# EAGLE design layout3 (EAGLE 7.2.0)
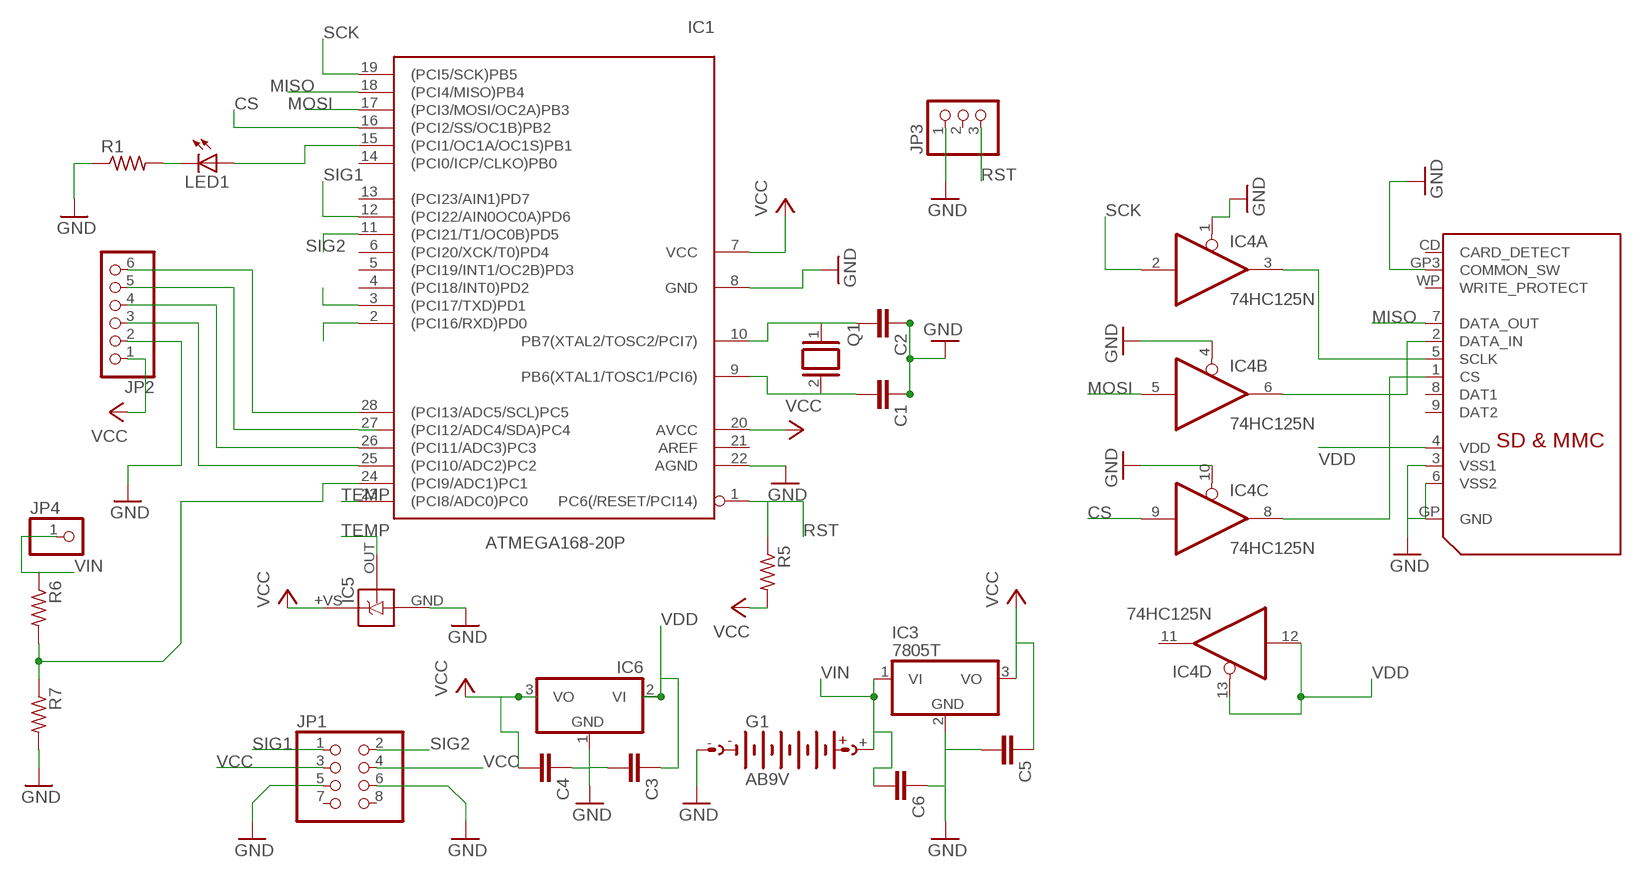
[diagram p0: schematic, sheet 1]

## Parts
C1  C-EU025-025X050  [C025-025X050]
C2  C-EU025-025X050  [C025-025X050]
C3  C-EU025-025X050  [C025-025X050]
C4  C-EU025-025X050  [C025-025X050]
C5  C-EU025-025X050  [C025-025X050]
C6  C-EU025-025X050  [C025-025X050]
G1  AB9V  [AB9V]
IC1  ATMEGA168-20P  [DIL28-3]
IC3  7805T  [TO220H]
IC4  74HC125N  [DIL14]
IC5  LM35  [TO-92-]
IC6  7906T  [TO220H]
JP1  PINHD-2X4  [2X04]
JP2  PINHD-1X6CB  [1X06-CLEANBIG]
JP3  PINHD-1X3CB  [1X03-CLEANBIG]
JP4  PINHD-1X1CB  [1X01-CLEANBIG]
LED1  LED5MM  [LED5MM]
Q1  XTAL/S  [QS]
R1  R-US_0207/10  [0207/10]
R5  R-US_0207/10  [0207/10]
R6  R-US_0207/10  [0207/10]
R7  R-US_0207/10  [0207/10]
U$1  SDMMC06132  [06132]

## Nets
CS: IC1.16((PCI2/SS/OC1B)PB2) IC4.9(C:I)
GND: C1.1 C2.1 C3.2 C4.1 C5.2 C6.1 G1.- IC1.8(GND) IC1.22(AGND) IC3.2(GND) IC4.1(A:OE) IC4.4(B:OE) IC4.10(C:OE) IC5.GND IC6.1(GND) JP1.5 JP1.6 JP2.2 JP3.1 R1.1 R7.2 U$1.3(VSS1) U$1.6(VSS2) U$1.GP3(COMMON_SW) U$1.GP(GND)
MISO: IC1.18((PCI4/MISO)PB4) U$1.7(DATA_OUT)
MOSI: IC1.17((PCI3/MOSI/OC2A)PB3) IC4.5(B:I)
N$1: C1.2 IC1.9(PB6(XTAL1/TOSC1/PCI6)) Q1.2
N$2: C2.2 IC1.10(PB7(XTAL2/TOSC2/PCI7)) Q1.1
N$3: IC1.28((PCI13/ADC5/SCL)PC5) JP2.6
N$4: IC1.26((PCI11/ADC3)PC3) JP2.4
N$5: IC1.27((PCI12/ADC4/SDA)PC4) JP2.5
N$6: IC1.25((PCI10/ADC2)PC2) JP2.3
N$8: IC4.6(B:O) U$1.2(DATA_IN)
N$9: IC4.3(A:O) U$1.5(SCLK)
N$10: IC4.8(C:O) U$1.1(CS)
N$11: IC1.24((PCI9/ADC1)PC1) R6.2 R7.1
N$12: LED1.K(C) R1.2
N$13: IC1.15((PCI1/OC1A/OC1S)PB1) LED1.A
N$21: IC1.2((PCI16/RXD)PD0)
N$22: IC1.3((PCI17/TXD)PD1)
RST: IC1.1(PC6(/RESET/PCI14)) JP3.3 R5.1
SCK: IC1.19((PCI5/SCK)PB5) IC4.2(A:I)
SIG1: IC1.12((PCI22/AIN0OC0A)PD6) JP1.1
SIG2: IC1.11((PCI21/T1/OC0B)PD5) JP1.2
TEMP: IC1.23((PCI8/ADC0)PC0) IC5.OUT
VCC: C4.2 C5.1 IC1.7(VCC) IC1.20(AVCC) IC3.3(VO) IC5.+VS IC6.3(VO) JP1.3 JP1.4 JP2.1 R5.2
VDD: C3.1 IC4.12(D:I) IC4.13(D:OE) IC6.2(VI) U$1.4(VDD)
VIN: C6.2 G1.+ IC3.1(VI) JP4.1 R6.1
Unconnected: IC1.4((PCI18/INT0)PD2) IC1.5((PCI19/INT1/OC2B)PD3) IC1.6((PCI20/XCK/T0)PD4) IC1.13((PCI23/AIN1)PD7) IC1.14((PCI0/ICP/CLKO)PB0) IC1.21(AREF) IC4.11(D:O) JP1.7 JP1.8 JP3.2 U$1.8(DAT1) U$1.9(DAT2) U$1.CD(CARD_DETECT) U$1.WP(WRITE_PROTECT)

## Power pins joined to a net without a drawn wire
GND: IC4.7(P:GND)
VCC: IC4.14(P:VCC)

## Library data of the parts
C1-C6 = rcl:C-EU: CAPACITOR, European symbol
G1 = battery:AB9V: 9-V BATTERY CLIP
IC1 = adafruit:ATMEGA168*P: MICROCONTROLLER 16 kBytes FLASH 1 kBytes SRAM 512 Bytes EEPROM USART 8-channel 10 bit ADC
IC3 = linear:78*: Positive VOLTAGE REGULATOR Source: http://cache.national.com/ds/LM/LM78L05.pdf http://www.fairchildsemi.com/ds/LM/LM7805.pdf
IC4 = 74xx-eu:74*125: Quad bus BUFFER, 3-state
IC5 = LM35:LM35
IC6 = linear:79*: Negative VOLTAGE REGULATOR
JP1 = adafruit:PINHD-2X4: PIN HEADER
JP2 = adafruit:PINHD-1X6: PIN HEADER
JP3 = adafruit:PINHD-1X3: PIN HEADER
JP4 = adafruit:PINHD-1X1: Pin header 1x1 for 0.1" spacing With round pins
LED1 = adafruit:LED: LED OSRAM: - CHIPLED LG R971, LG N971, LY N971, LG Q971, LY Q971, LO R971, LY R971 LH N974, LH R974 LS Q976, LO Q976, LY Q976 LO Q996 - Hyper CHIPLED LW Q18S LB Q993, LB Q99A, LB R99A - SideLED LS A670, LO A670, LY A670, LG A670, LP A670 LB A673, LV A673, LT A673, LW A673 LH A674 LY A675 LS A676, LA A676, LO A676, LY A676, LW A676 LS A679, LY A679, LG A679 - Hyper Micro SIDELED® LS Y876, LA Y876, LO Y876, LY Y876 LT Y87S - SmartLED LW L88C, LW L88S LB L89C, LB L89S, LG L890 LS L89K, LO L89K, LY L89K LS L896, LA L896, LO L896, LY L896 - TOPLED LS T670, LO T670, LY T670, LG T670, LP T670 LSG T670, LSP T670, LSY T670, LOP T670, LYG T670 LG T671, LOG T671, LSG T671 LB T673, LV T673, LT T673, LW T673 LH T674 LS T676, LA T676, LO T676, LY T676, LB T676, LH T676, LSB T676, LW T676 LB T67C, LV T67C, LT T67C, LS T67K, LO T67K, LY T67K, LW E67C LS E67B, LA E67B, LO E67B, LY E67B, LB E67C, LV E67C, LT E67C LW T67C LS T679, LY T679, LG T679 LS T770, LO T770, LY T770, LG T770, LP T770 LB T773, LV T773, LT T773, LW T773 LH T774 LS E675, LA E675, LY E675, LS T675 LS T776, LA T776, LO T776, LY T776, LB T776 LHGB T686 LT T68C, LB T68C - Hyper Mini TOPLED® LB M676 - Mini TOPLED Santana® LG M470 LS M47K, LO M47K, LY M47K Source: http://www.osram.convergy.de/
Q1 = special:XTAL/S: CRYSTAL
R1 R5-R7 = resistor:R-US_: RESISTOR, American symbol
U$1 = adafruit:SDMMC: SD MMC Card holder 4UCON part #06132 - easy to solder

## Board
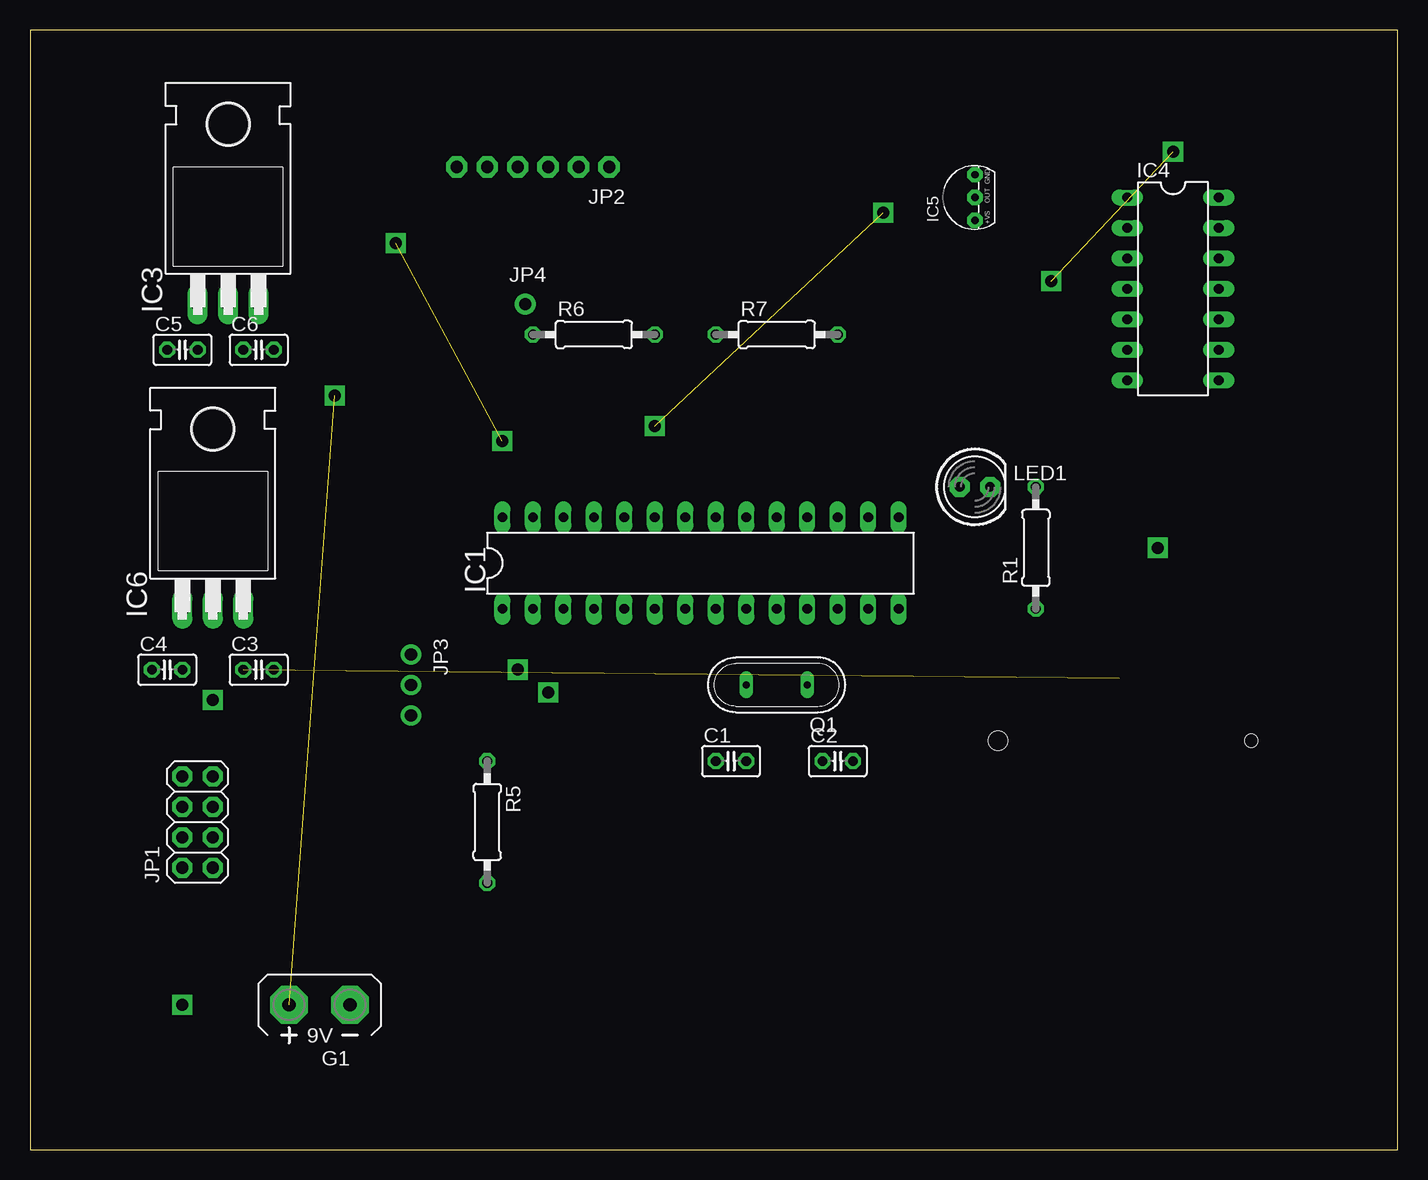
[diagram p1: board, top side]
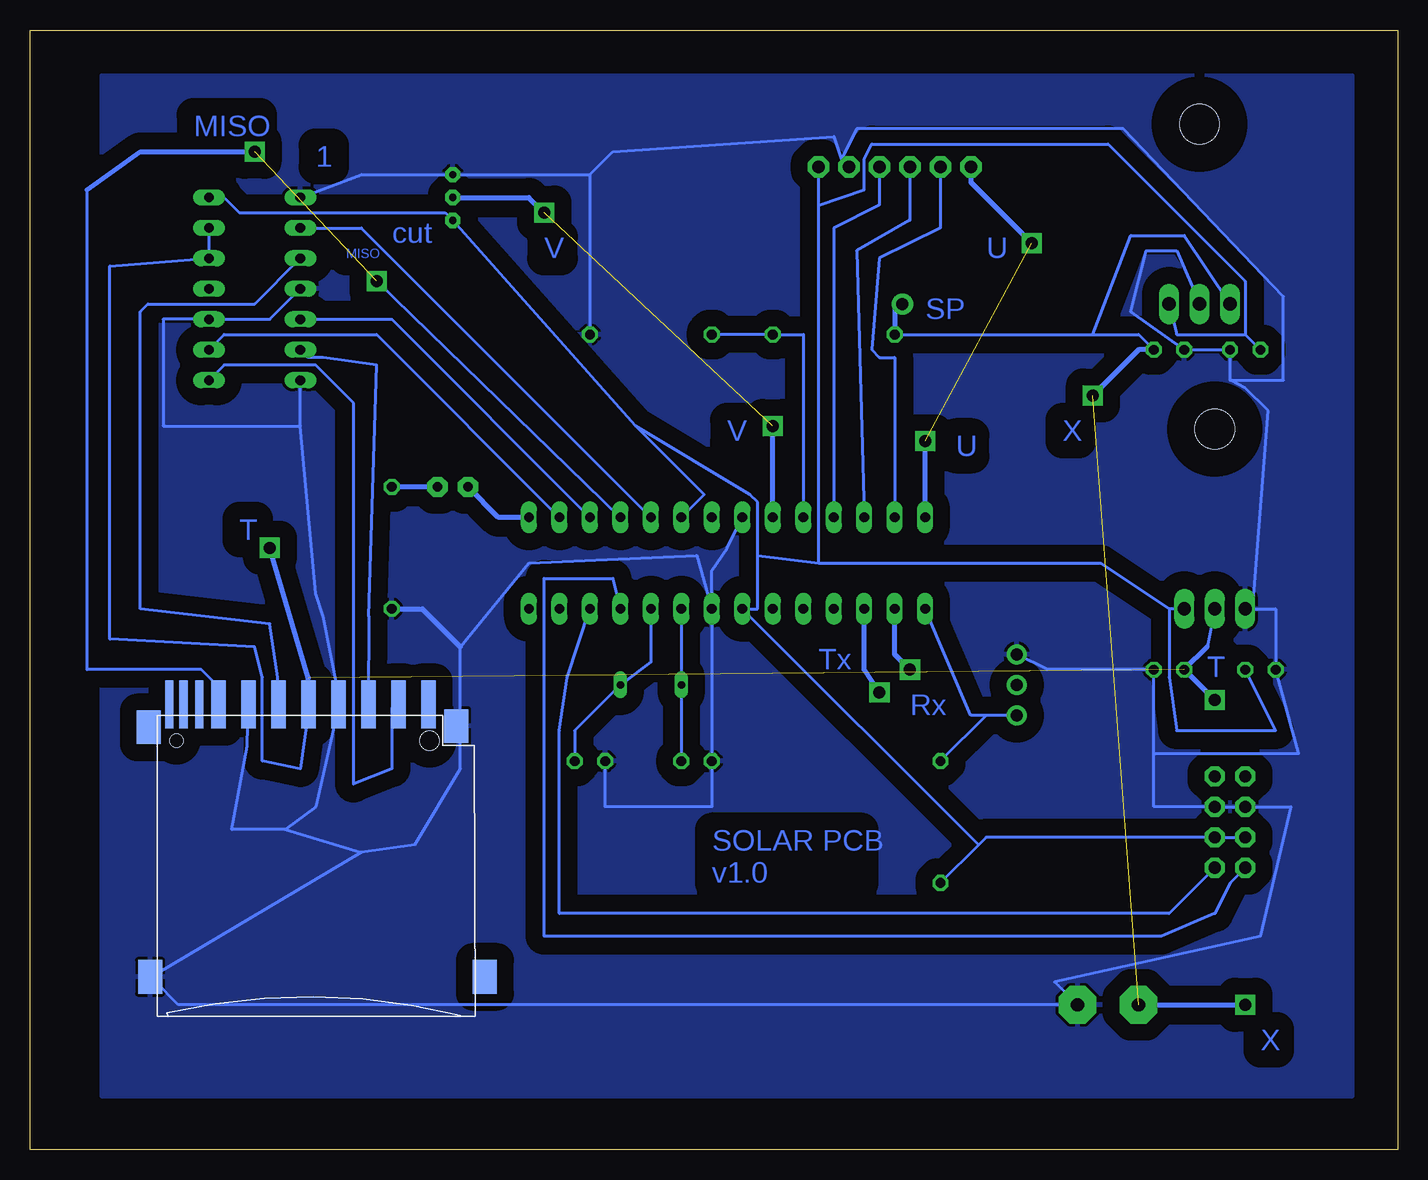
[diagram p2: board, bottom side, seen from below]

Size 113.97 x 93.34 mm. Coordinates in mm from the lower left corner, seen from the top.
Outline: 0,0 113.97,0 113.97,93.34 0,93.34 0,0
Copper layers (1*16): Top 0.035mm / dielectric 1.5mm / Bottom 0.035mm
Design rules "default": minimum track width 10mil, minimum drill 24mil, track to track 8mil, track to pad 8mil, pad to pad 8mil, via to via 8mil, smd to smd 8mil, copper to edge 40mil, drill to drill 8mil, minimum pad ring 10mil, minimum via ring 8mil, stop-mask expansion 4mil, vias tented up to drill 0mil, thermal gap 10mil

### Footprints (pad centres in the part's own frame; a part is rotated, then mirrored left to right if it is on the bottom)
C025-025X050 = drill 0.813 octagon: 1 -1.27,0; 2 1.27,0
AB9V = drill 1.118 pad 3.15 octagon: + 0,2.54; - 0,-2.54
DIL28-3 = drill 0.813 long: 1 -16.51,-3.81; 2 -13.97,-3.81; 3 -11.43,-3.81; 4 -8.89,-3.81; 5 -6.35,-3.81; 6 -3.81,-3.81; 7 -1.27,-3.81; 8 1.27,-3.81; 9 3.81,-3.81; 10 6.35,-3.81; 11 8.89,-3.81; 12 11.43,-3.81; 13 13.97,-3.81; 14 16.51,-3.81; 15 16.51,3.81; 16 13.97,3.81; 17 11.43,3.81; 18 8.89,3.81; 19 6.35,3.81; 20 3.81,3.81; 21 1.27,3.81; 22 -1.27,3.81; 23 -3.81,3.81; 24 -6.35,3.81; 25 -8.89,3.81; 26 -11.43,3.81; 27 -13.97,3.81; 28 -16.51,3.81
TO220H = drill 1.118 long: 1 -2.54,-10.16; 2 0,-10.16; 3 2.54,-10.16 | hole 3.302: 0,4.826
DIL14 = drill 0.813 long: 1 -7.62,-3.81; 2 -5.08,-3.81; 3 -2.54,-3.81; 4 0,-3.81; 5 2.54,-3.81; 6 5.08,-3.81; 7 7.62,-3.81; 8 7.62,3.81; 9 5.08,3.81; 10 2.54,3.81; 11 0,3.81; 12 -2.54,3.81; 13 -5.08,3.81; 14 -7.62,3.81
TO-92- = drill 0.61 pad 1.27 octagon: +VS -1.905,0; GND 1.905,0; OUT 0,0
2X04 = drill 1.016 pad 1.676 octagon: 1 -3.81,-1.27; 2 -3.81,1.27; 3 -1.27,-1.27; 4 -1.27,1.27; 5 1.27,-1.27; 6 1.27,1.27; 7 3.81,-1.27; 8 3.81,1.27
1X06-CLEANBIG = drill 1.016 pad 1.778 octagon: 1 -6.35,0; 2 -3.81,0; 3 -1.27,0; 4 1.27,0; 5 3.81,0; 6 6.35,0
1X03-CLEANBIG = drill 1.016 pad 1.676: 1 -2.54,0; 2 0,0; 3 2.54,0
1X01-CLEANBIG = drill 1.016 pad 1.778: 1 0,0
LED5MM = drill 0.813 pad 1.676 octagon: A -1.27,0; K 1.27,0
QS = drill 0.61 long: 1 -2.54,0; 2 2.54,0
0207/10 = drill 0.813 octagon: 1 -5.08,0; 2 5.08,0
06132 = smd 1.2 x 4: 1 6.9,0.9; 2 4.4,0.9; 3 1.9,0.9; 4 -0.6,0.9; 5 -3.1,0.9; 6 -5.6,0.9; 7 -8.1,0.9; 9 9.4,0.9 | smd 0.7 x 4: 8 -9.7,0.9; CD -11,0.9; WP -12.2,0.9 | smd 2 x 2.8: GP -13.8,-21.8; GP2 14.1,-21.8; GP3 11.7,-0.9; GP4 -13.9,-1 | hole 1.1: -11.6,-2.1 | hole 1.6: 9.5,-2.1

### Placement (x,y rotation side)
C1  58.42,32.39 0 top
C2  67.31,32.39 0 top
C3  19.05,40 0 top
C4  11.43,40 0 top
C5  12.7,66.67 0 top
C6  19.05,66.67 0 top
G1  24.13,12.06 90 top
IC1  55.88,48.89 0 top
IC3  16.51,80.65 0 top
IC4  95.25,71.76 270 top
IC5  78.74,79.38 90 top
IC6  15.24,55.25 0 top
JP1  13.97,27.3 90 top
JP2  41.91,81.92 180 top
JP3  31.75,38.73 270 top
JP4  41.27,70.48 0 top
LED1  78.74,55.25 0 top
Q1  62.23,38.73 180 top
R1  83.82,50.17 90 top
R5  38.1,27.3 270 top
R6  46.99,67.94 0 top
R7  62.23,67.94 0 top
U$1  90.17,36.2 0 bottom

### Tracks (layer width: path | path; a pad name or v marks a point on that pad's centre or on a via)
CS
  Bottom 0.254: IC1.16 85.09,67.94 97.79,67.94 IC4.9
GND
  Bottom 0.254: IC1.22 55.88,50.17 57.15,48.26 IC1.8 | IC1.8 C1.1 57.15,28.57 66.04,28.57 C2.1 | 91.44,60.33 IC4.7 | 91.44,60.33 102.87,60.33 102.87,69.22 IC4.10 93.98,69.22 IC4.4 | 92.71,26.67 90.17,28.57 88.27,36.83 U$1.3 88.27,37.47 88.27,38.1 89.53,44.45 90.17,46.36 91.44,60.33 | 92.71,26.67 86.36,24.77 | 86.36,24.77 103.5,14.61 U$1.GP 103.5,13.97 101.6,12.06 G1.- 28.58,13.97 11.43,17.78 8.89,28.57 JP1.6 JP1.5 20.32,28.57 20.32,33.02 | 86.36,24.77 81.91,25.4 78.1,31.75 78.1,34.92 U$1.GP3 78.1,35.56 78.1,41.91 72.39,48.89 58.42,49.53 IC1.8 | 92.71,26.67 97.16,26.67 95.88,33.66 U$1.6 | IC4.1 86.36,81.28 IC5.GND 67.31,81.28 | 67.31,81.28 R7.2 | 46.36,82.55 46.99,84.45 65.41,83.19 67.31,81.28 | 46.36,82.55 JP2.2 | IC3.2 18.41,74.93 20.95,74.93 22.23,69.85 C6.1 C5.2 13.97,64.14 | 12.06,45.08 10.16,45.08 C4.1 8.25,33.02 20.32,33.02 | 20.32,33.02 C3.2 29.21,40 JP3.1 | 13.97,64.14 12.7,63.5 10.79,61.59 12.06,45.08 | 12.06,45.08 IC6.1 | 46.36,82.55 45.09,85.09 22.86,85.09 9.52,71.12 9.52,64.14 13.97,64.14
  Bottom 0.406: R1.1 81.28,45.08 78.1,41.91
  pour Bottom (isolate 1.422): 6.35,89.53 3.81,89.53 3.81,4.45 107.95,4.45 107.95,9.53 107.95,89.53
MISO  (via drill 1 pad 1.68)  (1 unrouted)
  Bottom 0.254: v85.09,72.39 IC1.18 | 109.22,80.01 109.22,40 99.69,40 98.42,38.73 98.42,37.47 U$1.7
  Bottom 0.406: 109.22,80.01 104.77,83.19 95.25,83.19
MOSI
  Bottom 0.254: IC1.17 83.82,69.22 IC4.5
N$1
  Bottom 0.254: IC1.9 Q1.2 C1.2
N$2
  Bottom 0.254: IC1.10 62.23,40.64 Q1.1 68.58,34.92 C2.2
N$3  (via drill 1 pad 1.68)  (1 unrouted)
  Bottom 0.406: IC1.28 39.37,59.06 | JP2.6 35.56,80.65 v30.48,75.56
N$4
  Bottom 0.254: IC1.26 45.09,74.93 40.64,77.47 JP2.4
N$5
  Bottom 0.254: IC1.27 41.91,66.04 43.18,66.04 43.82,66.67 43.18,74.3 38.1,76.84 JP2.5
N$6
  Bottom 0.254: IC1.25 46.99,76.84 43.18,78.74 JP2.3
N$7  (via drill 1 pad 1.68)
  other vias: 39.37,59.06
N$8
  Bottom 0.254: IC4.6 90.8,66.04 89.53,66.04 85.09,65.41 85.72,44.45 U$1.2
N$9
  Bottom 0.254: IC4.3 95.25,70.48 104.14,70.48 104.77,69.85 104.77,45.08 93.98,43.81 93.34,39.37 93.34,37.47 U$1.5
N$10
  Bottom 0.254: IC4.8 97.79,65.41 90.17,65.41 86.99,62.23 86.99,30.48 83.82,31.75 83.82,36.83 U$1.1
N$11
  Bottom 0.254: IC1.24 49.53,67.94 R6.2 R7.1
N$12
  Bottom 0.406: LED1.K R1.2
N$13
  Bottom 0.406: IC1.15 74.93,52.7 LED1.A
N$14  (via drill 1 pad 1.68)
  other vias: 95.25,83.19
N$16  (via drill 1 pad 1.68)
  other vias: 12.7,12.06
N$17  (via drill 1 pad 1.68)
  other vias: 25.4,62.86
N$18  (via drill 1 pad 1.68)
  other vias: 93.98,50.17
N$19  (via drill 1 pad 1.68)
  other vias: 52.07,60.33
N$20  (via drill 1 pad 1.68)
  other vias: 71.12,78.11
N$21  (via drill 1 pad 1.68)
  Bottom 0.406: v40.64,40 41.91,41.28 IC1.2
N$22  (via drill 1 pad 1.68)
  Bottom 0.406: v43.18,38.1 44.45,40 IC1.3
RST
  Bottom 0.254: 34.29,36.2 R5.1 | JP3.3 34.29,36.2 | IC1.1 35.56,36.2 34.29,36.2
SCK
  Bottom 0.254: IC1.19 86.36,76.84 IC4.2
SIG1
  Bottom 0.254: IC1.12 69.22,39.37 69.85,34.92 69.85,19.69 19.05,19.69 JP1.1
SIG2
  Bottom 0.254: IC1.11 65.41,47.62 71.12,47.62 71.12,17.78 19.69,17.78 15.24,19.69 13.97,22.23 JP1.2
TEMP  (1 unrouted)
  Bottom 0.406: IC1.23 52.07,60.33 | IC5.OUT 72.39,79.38 71.12,78.11
VCC
  Bottom 0.254: IC4.14 97.79,79.38 96.52,78.11 79.38,78.11 IC5.+VS 63.5,60.33 | 12.7,67.94 C5.1 | 12.7,67.94 18.41,67.94 IC3.3 | C4.2 10.16,34.92 18.41,34.92 19.05,39.37 19.05,45.08 | IC6.3 19.05,45.08 | 34.92,25.4 34.29,26.04 JP1.3 JP1.4 | 34.92,25.4 R5.2 | 34.92,25.4 IC1.7 53.34,45.08 53.34,49.53 | IC1.20 57.79,54.61 63.5,60.33 | 63.5,60.33 53.98,54.61 53.34,53.97 53.34,49.53 | 48.26,48.89 48.26,78.74 | 48.26,78.74 JP2.1 | 53.34,49.53 48.26,48.89 | 19.05,45.08 24.77,48.89 48.26,48.89 | 12.7,67.94 12.7,72.39 24.13,83.82 43.82,83.82 44.45,82.55 44.45,80.01 48.26,78.74
VDD  (via drill 1 pad 1.68)  (1 unrouted)
  Bottom 0.254: IC6.2 15.88,41.91 | IC4.13 IC4.12 107.31,73.66 107.31,42.55 95.25,41.91 94.61,39.37 94.61,32.39 91.44,31.75 90.8,36.2 90.8,36.83 U$1.4
  Bottom 0.406: U$1.4 90.77,39.33 93.98,50.17 | 15.88,41.91 C3.1 v15.24,37.47
VIN  (1 unrouted)
  Bottom 0.254: C6.2 21.59,67.94 25.4,67.94 | R6.1 25.4,67.94 | IC3.1 17.78,76.2 22.23,76.2 25.4,67.94
  Bottom 0.406: C6.2 21.59,66.67 25.4,62.86 | G1.+ 12.7,12.06 | JP4.1 41.91,70.48 R6.1

### Text on the board
Bottom: MISO | 1 | cut | U | V | MISO | SP | X | V | U | T | T | Tx | Rx | SOLAR PCB / v1.0 | X